# Altium project 单片机控制电路.PrjPcb
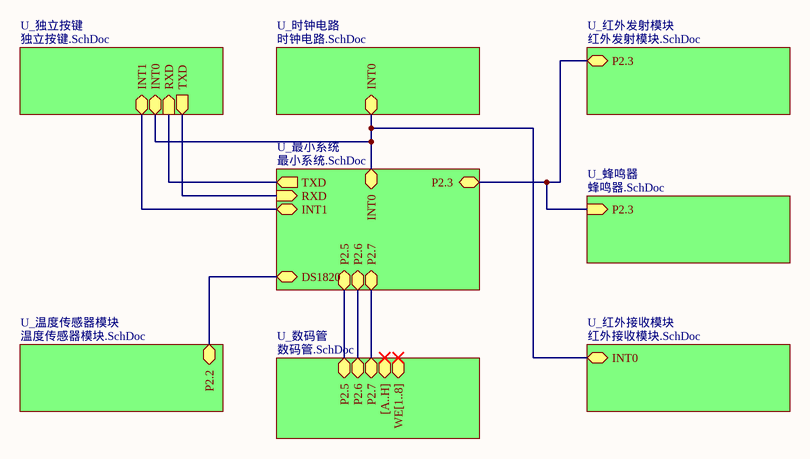
[diagram p0: 单片机控制电路.SchDoc]
9 sheets, 32 parts. Net scope: hierarchical (ports join the sheet entries above them; power ports are global).
Board file: 单片机控制电路.PcbDoc
Sheets:
  单片机控制电路.SchDoc
    U_最小系统 = 最小系统.SchDoc
    U_时钟电路 = 时钟电路.SchDoc
    U_温度传感器模块 = 温度传感器模块.SchDoc
    U_独立按键 = 独立按键.SchDoc
    U_红外发射模块 = 红外发射模块.SchDoc
    U_红外接收模块 = 红外接收模块.SchDoc
    U_蜂鸣器 = 蜂鸣器.SchDoc
    U_数码管 = 数码管.SchDoc

## Sheet 单片机控制电路.SchDoc
size A4; Time: 22/05/16

### Sub-sheets
U_数码管 = 数码管.SchDoc: P2.5 (bidir), P2.6 (bidir), P2.7 (bidir), [A..H] (bidir), WE[1..8] (bidir)
U_时钟电路 = 时钟电路.SchDoc: INT0 (bidir)
U_最小系统 = 最小系统.SchDoc: P2.5 (bidir), P2.6 (bidir), P2.7 (bidir), P2.3 (bidir), DS1820 (bidir), RXD (in), TXD (out), INT0 (bidir), INT1 (bidir)
U_温度传感器模块 = 温度传感器模块.SchDoc: P2.2 (bidir)
U_独立按键 = 独立按键.SchDoc: TXD (out), RXD (in), INT0 (bidir), INT1 (bidir)
U_红外发射模块 = 红外发射模块.SchDoc: P2.3 (bidir)
U_红外接收模块 = 红外接收模块.SchDoc: INT0 (bidir)
U_蜂鸣器 = 蜂鸣器.SchDoc: P2.3 (in)

### Nets
P22/DS1820: sheet U_最小系统/DS1820, sheet U_温度传感器模块/P2.2
P23: sheet U_最小系统/P2.3, sheet U_红外发射模块/P2.3, sheet U_蜂鸣器/P2.3
P25: sheet U_最小系统/P2.5, sheet U_数码管/P2.5
P26: sheet U_最小系统/P2.6, sheet U_数码管/P2.6
P27: sheet U_最小系统/P2.7, sheet U_数码管/P2.7
P30/RxD: sheet U_最小系统/RXD, sheet U_独立按键/TXD
P31/RXD: sheet U_最小系统/TXD, sheet U_独立按键/RXD
P32/INT0: sheet U_最小系统/INT0, sheet U_时钟电路/INT0, sheet U_独立按键/INT0, sheet U_红外接收模块/INT0
P32/INT1: sheet U_最小系统/INT1, sheet U_独立按键/INT1

### Notes on the sheet
- 专升本
- 通信工程
- 李烨攀
- 2101班
- 210806300163
- 学号

## Sheet 最小系统.SchDoc
size A4; Time: 2022/05/15
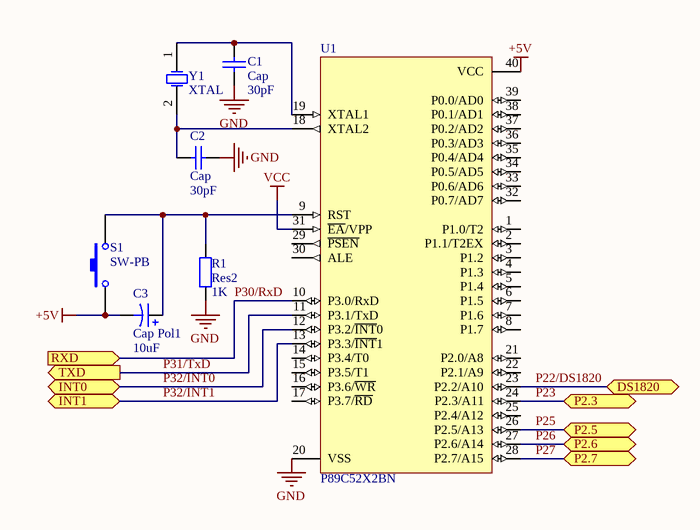
[diagram p1: 最小系统.SchDoc]

### Parts
C1  Cap  value 30pF  [RAD-0.3]
C2  Cap  value 30pF  [RAD-0.3]
C3  Cap Pol1  value 10uF  [RB7.6-15]
R1  Res2  value 1K  [AXIAL-0.4]
S1  SW-PB  [SPST-2]
U1  P89C52X2BN  [SOT129-1]
Y1  XTAL  [R38]

### Ports
DS1820 (bidir), INT0 (bidir), INT1 (bidir), P2.3 (bidir), P2.5 (bidir), P2.6 (bidir), P2.7 (bidir), RXD (in), TXD (out)

### Nets
+5V: C3.2 S1.1 U1.40(VCC)
GND: C1.1 C2.1 R1.1 U1.20(VSS)
VCC: U1.31(~{EA}/VPP)
P22/DS1820: U1.23(P2.2/A10) ; port DS1820
P23: U1.24(P2.3/A11) ; port P2.3
P25: U1.26(P2.5/A13) ; port P2.5
P26: U1.27(P2.6/A14) ; port P2.6
P27: U1.28(P2.7/A15) ; port P2.7
P30/RxD: U1.10(P3.0/RxD) ; port RXD
P31/TxD: U1.11(P3.1/TxD) ; port TXD  [project net P31/RXD]
P32/INT0: U1.12(P3.2/~{INT}0) ; port INT0
P32/INT1: U1.13(P3.3/~{INT}1) ; port INT1
NetC1_2: C1.2 U1.19(XTAL1) Y1.1(OSC1)
NetC2_2: C2.2 U1.18(XTAL2) Y1.2(OSC2)
NetC3_1: C3.1 R1.2 S1.2 U1.9(RST)

Not connected (* = marked no-connect by the designer): U1 1(P1.0/T2) 2(P1.1/T2EX) 3(P1.2) 4(P1.3) 5(P1.4) 6(P1.5) 7(P1.6) 8(P1.7) 14(P3.4/T0) 15(P3.5/T1) 16(P3.6/~{WR}) 17(P3.7/~{RD}) 21(P2.0/A8) 22(P2.1/A9) 25(P2.4/A12) 29(~{PSEN}) 30(ALE) 32(P0.7/AD7) 33(P0.6/AD6) 34(P0.5/AD5) 35(P0.4/AD4) 36(P0.3/AD3) 37(P0.2/AD2) 38(P0.1/AD1) 39(P0.0/AD0)

### Notes on the sheet
- 专升本
- 通信工程
- 李烨攀
- 2101班
- 210806300163
- 学号

### Library data of the parts
C1 C2 = Cap: Capacitor; Published: 8-Jun-2000; LatestRevisionDate: 17-Jul-2002; LatestRevisionNote: Re-released for DXP Platform.; PackageReference: RAD-0.3; Publisher: Altium Limited; PackageDescription: Radial Cap, Thru-Hole; 2 Leads; 0.3 in Pin Spacing
C3 = Cap Pol1: Polarized Capacitor (Radial); Published: 8-Jun-2000; LatestRevisionDate: 17-Jul-2002; LatestRevisionNote: Re-released for DXP Platform.; PackageReference: RB7.6-15; Publisher: Altium Limited; PackageDescription: Polarized Capacitor (Radial); 2 Leads
R1 = Res2: Resistor; Published: 8-Jun-2000; LatestRevisionDate: 17-Jul-2002; LatestRevisionNote: Re-released for DXP Platform.; PackageReference: AXIAL-0.4; Publisher: Altium Limited; PackageDescription: Axial Device, Thru-Hole; 2 Leads; 0.4 in Pin Spacing
S1 = SW-PB: Switch; Published: 24-Mar-1999; LatestRevisionDate: 17-Jul-2002; LatestRevisionNote: Re-released for DXP Platform.; PackageReference: SPST-2; Publisher: Altium Limited; PackageDescription: Switch; 2 Leads
U1 = P89C52X2BN: 80C51 8-Bit Flash Microcontroller Family, 8 kB Flash; Published: 21-May-2003; DatasheetVersion: 5-Jun-2002; PackageVersion: Aug-2000; PackageReference: SOT129-1; Publisher: Altium Limited; PackageDescription: DIP, Plastic; 40 Leads; Row Spacing 15.24 mm; Pitch 2.54 mm; Code_JEDEC: MO-015; ComponentLink1Description: Manufacturer Link; ComponentLink1URL: http://www-us2.semiconductors.philips.com/; ComponentLink2Description: Datasheet; ComponentLink2URL: http://www.semiconductors.philips.com/acrobat/datasheets/P89C5XX2_2.pdf
Y1 = XTAL: Crystal Oscillator; Published: 8-Jun-2000; LatestRevisionDate: 17-Jul-2002; LatestRevisionNote: Re-released for DXP Platform.; PackageReference: R38; Publisher: Altium Limited; PackageDescription: Crystal, Thru-Hole; 2 Leads; Body 3.1 x 8.2 mm (Dia.xH)

## Sheet 时钟电路.SchDoc
size A4
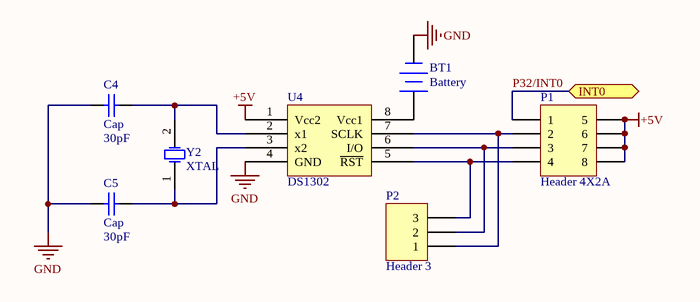
[diagram p2: 时钟电路.SchDoc]

### Parts
BT1  Battery  [BAT-2]
C4  Cap  value 30pF  [RAD-0.3]
C5  Cap  value 30pF  [RAD-0.3]
P1  Header 4X2A  [HDR2X4_CEN]
P2  Header 3  [HDR1X3]
U4  DS1302  [SOIC127P1030-8L]
Y2  XTAL  [R38]

### Ports
INT0 (bidir)

### Nets
+5V: P1.5 P1.6 P1.7 P1.8 U4.1(Vcc2)
GND: BT1.2(-) C4.2 C5.1 U4.4(GND)
P32/INT0: P1.1 ; port INT0
NetBT1_1: BT1.1(+) U4.8(Vcc1)
NetC4_1: C4.1 U4.2(x1) Y2.2(OSC2)
NetC5_2: C5.2 U4.3(x2) Y2.1(OSC1)
NetP1_2: P1.2 P2.1 U4.7(SCLK)
NetP1_3: P1.3 P2.2 U4.6(I/O)
NetP1_4: P1.4 P2.3 U4.5(~{RST})

### Notes on the sheet
- 专升本
- 通信工程
- 李烨攀
- 2101班
- 210806300163
- 学号

### Library data of the parts
BT1 = Battery: Multicell Battery; Published: 24-Mar-1999; LatestRevisionDate: 17-Jul-2002; LatestRevisionNote: Re-released for DXP Platform.; PackageReference: BAT-2; Publisher: Altium Limited; PackageDescription: Battery; 2 Leads
C4 C5 = Cap: Capacitor; Published: 8-Jun-2000; LatestRevisionDate: 17-Jul-2002; LatestRevisionNote: Re-released for DXP Platform.; PackageReference: RAD-0.3; Publisher: Altium Limited; PackageDescription: Radial Cap, Thru-Hole; 2 Leads; 0.3 in Pin Spacing
P1 = Header 4X2A: Header, 4-Pin, Dual row; LatestRevisionDate: 17-Jul-2002; LatestRevisionNote: Re-released for DXP Platform.; Publisher: Altium Limited
P2 = Header 3: Header, 3-Pin; LatestRevisionDate: 17-Jul-2002; LatestRevisionNote: Re-released for DXP Platform.; Publisher: Altium Limited
Y2 = XTAL: Crystal Oscillator; Published: 8-Jun-2000; LatestRevisionDate: 17-Jul-2002; LatestRevisionNote: Re-released for DXP Platform.; PackageReference: R38; Publisher: Altium Limited; PackageDescription: Crystal, Thru-Hole; 2 Leads; Body 3.1 x 8.2 mm (Dia.xH)

## Sheet 温度传感器模块.SchDoc
size A4
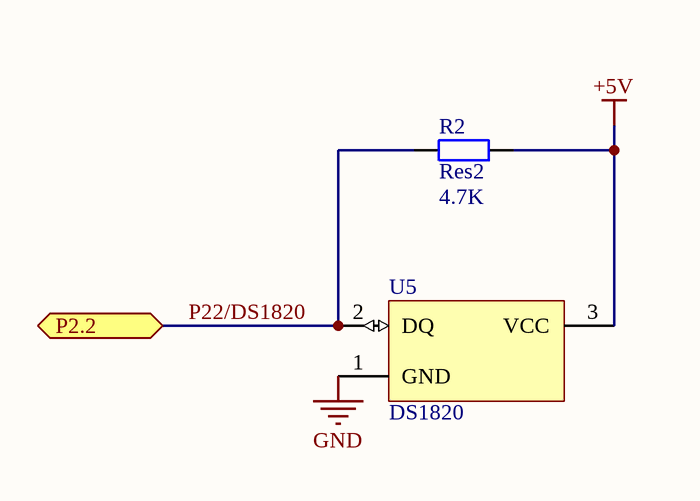
[diagram p3: 温度传感器模块.SchDoc]

### Parts
R2  Res2  value 4.7K  [AXIAL-0.4]
U5  DS1820  [PR35]

### Ports
P2.2 (bidir)

### Nets
+5V: R2.2 U5.3(VCC)
GND: U5.1(GND)
P22/DS1820: R2.1 U5.2(DQ) ; port P2.2

### Notes on the sheet
- 专升本
- 通信工程
- 李烨攀
- 2101班
- 210806300163
- 学号

### Library data of the parts
R2 = Res2: Resistor; Published: 8-Jun-2000; LatestRevisionDate: 17-Jul-2002; LatestRevisionNote: Re-released for DXP Platform.; PackageReference: AXIAL-0.4; Publisher: Altium Limited; PackageDescription: Axial Device, Thru-Hole; 2 Leads; 0.4 in Pin Spacing
U5 = DS1820: 1-Wire Digital Thermometer; ComponentAvailability: Obsolete; Published: 13-Oct-2000; LatestRevisionDate: 17-Jul-2002; LatestRevisionNote: Re-released for DXP Platform.; DatasheetVersion: 5-Mar-1998; PackageVersion: 1999; PackageReference: PR35; Publisher: Altium Limited; PackageDescription: TO, Flat Index; 3 In-Line, Axial Leads; Body Dia. 4.6mm; Leads 0.56 x 0.51 mm (max); ComponentLink1Description: Manufacturer Link; ComponentLink1URL: http://www.maxim-ic.com/; ComponentLink2Description: Datasheet; ComponentLink2URL: http://pdfserv.maxim-ic.com/en/ds/DS1820-DS1820S.pdf; ComponentLink3Description: Discontinuation Notice; ComponentLink3URL: http://www.maxim-ic.com/qa/pdfs/non-obsolescence-letter.pdf

## Sheet 独立按键.SchDoc
size A4
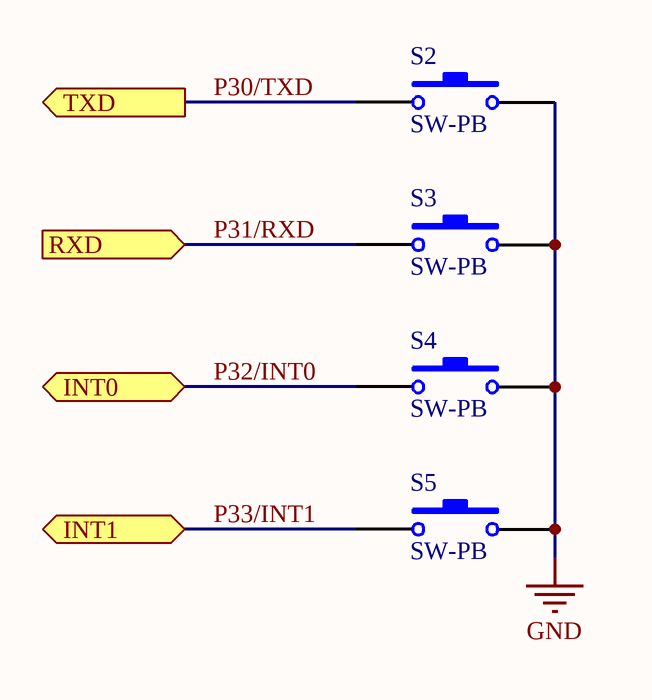
[diagram p4: 独立按键.SchDoc]

### Parts
S2  SW-PB  [SPST-2]
S3  SW-PB  [SPST-2]
S4  SW-PB  [SPST-2]
S5  SW-PB  [SPST-2]

### Ports
INT0 (bidir), INT1 (bidir), RXD (in), TXD (out)

### Nets
GND: S2.2 S3.2 S4.2 S5.2
P30/TXD: S2.1 ; port TXD  [project net P30/RxD]
P31/RXD: S3.1 ; port RXD
P32/INT0: S4.1 ; port INT0
P33/INT1: S5.1 ; port INT1  [project net P32/INT1]

### Notes on the sheet
- 专升本
- 通信工程
- 李烨攀
- 2101班
- 210806300163
- 学号

### Library data of the parts
S2-S5 = SW-PB: Switch; Published: 24-Mar-1999; LatestRevisionDate: 17-Jul-2002; LatestRevisionNote: Re-released for DXP Platform.; PackageReference: SPST-2; Publisher: Altium Limited; PackageDescription: Switch; 2 Leads

## Sheet 红外发射模块.SchDoc
size A4
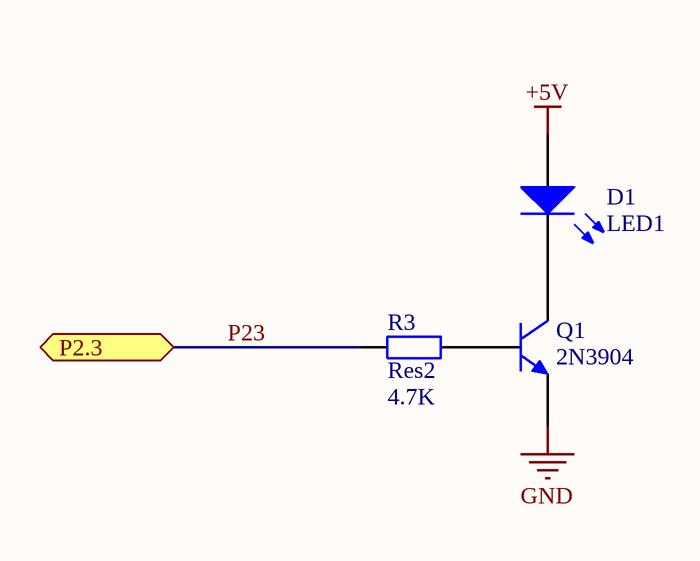
[diagram p5: 红外发射模块.SchDoc]

### Parts
D1  LED1  [LED-1]
Q1  2N3904  [TO-92A]
R3  Res2  value 4.7K  [AXIAL-0.4]

### Ports
P2.3 (bidir)

### Nets
+5V: D1.1(A)
GND: Q1.1(E)
P23: R3.1 ; port P2.3
NetD1_2: D1.2(K) Q1.3(C)
NetQ1_2: Q1.2(B) R3.2

### Notes on the sheet
- 专升本
- 通信工程
- 李烨攀
- 2101班
- 210806300163
- 学号

### Library data of the parts
D1 = LED1: Typical RED GaAs LED; Published: 8-Jun-2000; LatestRevisionDate: 08-Jul-2005; LatestRevisionNote: Mech Layer 1 removed.; PackageReference: LED-1; Publisher: Altium Limited; PackageDescription: LED; 2 Leads
Q1 = 2N3904: NPN General Purpose Amplifier; Published: 8-Jun-2000; LatestRevisionDate: 15-Jan-2003; LatestRevisionNote: PCB Footprint 'BCY-W3/D4.7' replaced; DatasheetVersion: 1997; PackageVersion: Sep-1998; PackageReference: TO-92A; Publisher: Altium Limited; PackageDescription: TO, Flat Index; 3 In-Line, Axial Leads; Body Dia. 4.5mm; Leads 0.51 x 0.48 mm (max); ComponentLink1Description: Manufacturer Link; ComponentLink1URL: http://www.fairchildsemi.com/; ComponentLink2Description: Datasheet; ComponentLink2URL: http://www.fairchildsemi.com/ds/2N%2F2N3904.pdf
R3 = Res2: Resistor; Published: 8-Jun-2000; LatestRevisionDate: 17-Jul-2002; LatestRevisionNote: Re-released for DXP Platform.; PackageReference: AXIAL-0.4; Publisher: Altium Limited; PackageDescription: Axial Device, Thru-Hole; 2 Leads; 0.4 in Pin Spacing

## Sheet 红外接收模块.SchDoc
size A4
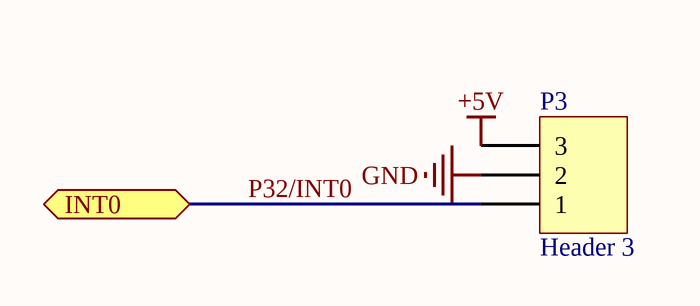
[diagram p6: 红外接收模块.SchDoc]

### Parts
P3  Header 3  [HDR1X3]

### Ports
INT0 (bidir)

### Nets
+5V: P3.3
GND: P3.2
P32/INT0: P3.1 ; port INT0

### Notes on the sheet
- 专升本
- 通信工程
- 李烨攀
- 2101班
- 210806300163
- 学号

### Library data of the parts
P3 = Header 3: Header, 3-Pin; LatestRevisionDate: 17-Jul-2002; LatestRevisionNote: Re-released for DXP Platform.; Publisher: Altium Limited

## Sheet 蜂鸣器.SchDoc
size A4
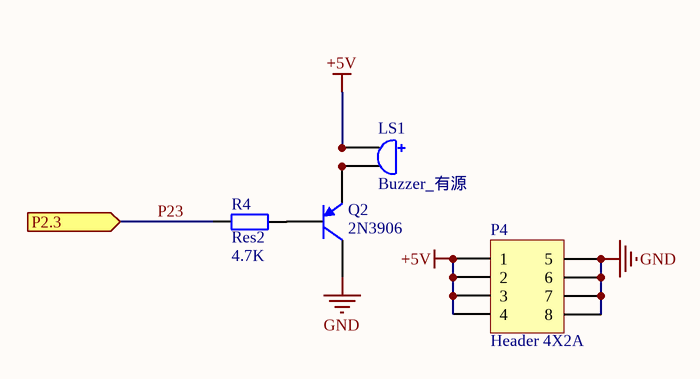
[diagram p7: 蜂鸣器.SchDoc]

### Parts
LS1  Buzzer_有源  [DIP6.6_2P]
P4  Header 4X2A  [HDR2X4_CEN]
Q2  2N3906  [TO-92A]
R4  Res2  value 4.7K  [AXIAL-0.4]

### Ports
P2.3 (in)

### Nets
+5V: LS1.1 P4.1 P4.2 P4.3 P4.4
GND: P4.5 P4.6 P4.7 P4.8 Q2.3(C)
P23: R4.1 ; port P2.3
NetLS1_2: LS1.2 Q2.1(E)
NetQ2_2: Q2.2(B) R4.2

### Notes on the sheet
- 专升本
- 通信工程
- 李烨攀
- 2101班
- 210806300163
- 学号

### Library data of the parts
P4 = Header 4X2A: Header, 4-Pin, Dual row; LatestRevisionDate: 17-Jul-2002; LatestRevisionNote: Re-released for DXP Platform.; Publisher: Altium Limited
Q2 = 2N3906: PNP General Purpose Amplifier; Published: 8-Jun-2000; LatestRevisionDate: 15-Jan-2003; LatestRevisionNote: PCB Footprint 'BCY-W3/D4.7' replaced; DatasheetVersion: 1997; PackageVersion: Sep-1998; PackageReference: TO-92A; Publisher: Altium Limited; PackageDescription: TO, Flat Index; 3 In-Line, Axial Leads; Body Dia. 4.5mm; Leads 0.51 x 0.48 mm (max); ComponentLink1Description: Manufacturer Link; ComponentLink1URL: http://www.fairchildsemi.com/; ComponentLink2Description: Datasheet; ComponentLink2URL: http://www.fairchildsemi.com/ds/2N%2F2N3906.pdf
R4 = Res2: Resistor; Published: 8-Jun-2000; LatestRevisionDate: 17-Jul-2002; LatestRevisionNote: Re-released for DXP Platform.; PackageReference: AXIAL-0.4; Publisher: Altium Limited; PackageDescription: Axial Device, Thru-Hole; 2 Leads; 0.4 in Pin Spacing

## Sheet 数码管.SchDoc
size A4
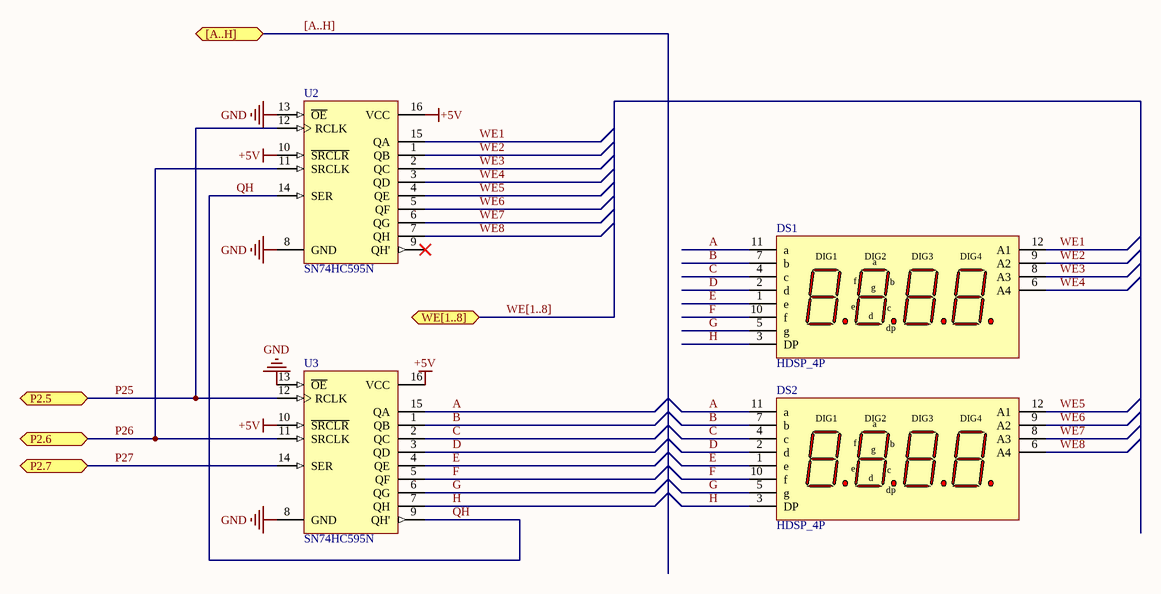
[diagram p8: 数码管.SchDoc]

### Parts
DS1  HDSP_4P  [HDSP_B4_数码管]
DS2  HDSP_4P  [HDSP_B4_数码管]
U2  SN74HC595N  [N016]
U3  SN74HC595N  [N016]

### Ports
[A..H] (bidir), P2.5 (bidir), P2.6 (bidir), P2.7 (bidir), WE[1..8] (bidir)

### Nets
+5V: U2.10(~{SRCLR}) U2.16(VCC) U3.10(~{SRCLR}) U3.16(VCC)
GND: U2.8(GND) U2.13(~{OE}) U3.8(GND) U3.13(~{OE})
A: DS1.11(a) DS2.11(a) U3.15(QA)
B: DS1.7(b) DS2.7(b) U3.1(QB)
C: DS1.4(c) DS2.4(c) U3.2(QC)
D: DS1.2(d) DS2.2(d) U3.3(QD)
E: DS1.1(e) DS2.1(e) U3.4(QE)
F: DS1.10(f) DS2.10(f) U3.5(QF)
G: DS1.5(g) DS2.5(g) U3.6(QG)
H: DS1.3(DP) DS2.3(DP) U3.7(QH)
P25: U2.12(RCLK) U3.12(RCLK) ; port P2.5
P26: U2.11(SRCLK) U3.11(SRCLK) ; port P2.6
P27: U3.14(SER) ; port P2.7
QH: U2.14(SER) U3.9(QH')
WE1: DS1.12(A1) U2.15(QA)
WE2: DS1.9(A2) U2.1(QB)
WE3: DS1.8(A3) U2.2(QC)
WE4: DS1.6(A4) U2.3(QD)
WE5: DS2.12(A1) U2.4(QE)
WE6: DS2.9(A2) U2.5(QF)
WE7: DS2.8(A3) U2.6(QG)
WE8: DS2.6(A4) U2.7(QH)

Not connected (* = marked no-connect by the designer): U2 9(QH')*

### Buses and harness runs
bus [A..H] = port [A..H]
bus WE[1..8] = port WE[1..8]

### Notes on the sheet
- 专升本
- 通信工程
- 李烨攀
- 2101班
- 210806300163
- 学号
- (in symbol HDSP_4P) DIG1; DIG2; DIG3; DIG4; dp

### Library data of the parts
U2 U3 = SN74HC595N: 8-Bit Shift Register with 3-State Output Registers; Published: 8-Jun-2000; LatestRevisionDate: 04-Mar-2005; LatestRevisionNote: Stylized 3D Model Added.; DatasheetVersion: May-1997; PackageVersion: Oct-1995; PackageReference: N016; Publisher: Altium Limited; PackageDescription: DIP; 16 Leads; Row Spacing 7.62 mm; Pitch 2.54 mm; Code_JEDEC: MS-001-BB; ComponentLink1Description: Manufacturer Link; ComponentLink1URL: http://www.ti.com/; ComponentLink2Description: Datasheet; ComponentLink2URL: http://www-s.ti.com/sc/ds/sn74hc595.pdf

## Nets that join several sheets
+5V: 最小系统 (C3.2 S1.1 U1.40), 时钟电路 (5 pins), 温度传感器模块 (R2.2 U5.3), 红外发射模块 (D1.1), 红外接收模块 (P3.3), 蜂鸣器 (5 pins), 数码管 (U2.10 U2.16 U3.10 U3.16)
GND: 最小系统 (C1.1 C2.1 R1.1 U1.20), 时钟电路 (BT1.2 C4.2 C5.1 U4.4), 温度传感器模块 (U5.1), 独立按键 (S2.2 S3.2 S4.2 S5.2), 红外发射模块 (Q1.1), 红外接收模块 (P3.2), 蜂鸣器 (5 pins), 数码管 (U2.8 U2.13 U3.8 U3.13)
P22/DS1820: 最小系统 (U1.23), 温度传感器模块 (R2.1 U5.2)
P23: 最小系统 (U1.24), 红外发射模块 (R3.1), 蜂鸣器 (R4.1)
P25: 最小系统 (U1.26), 数码管 (U2.12 U3.12)
P26: 最小系统 (U1.27), 数码管 (U2.11 U3.11)
P27: 最小系统 (U1.28), 数码管 (U3.14)
P30/RxD: 最小系统 (U1.10), 独立按键 (S2.1)
P31/RXD: 最小系统 (U1.11), 独立按键 (S3.1)
P32/INT0: 最小系统 (U1.12), 时钟电路 (P1.1), 独立按键 (S4.1), 红外接收模块 (P3.1)
P32/INT1: 最小系统 (U1.13), 独立按键 (S5.1)